# EasyEDA Pro project ProPrj_transverter-front-end_2026-04-14.epro, schematic transverter-control-board
Board Name: transverter-control-board; Create Date: 2026-04-02; Page Name: control-board; Project Name: transverter-front-end; Schematic Name: transverter-control-board; Update Date: 2026-04-08; Add into BOM: yes; Company: Your Company; Convert to PCB: yes; Date: 2026-03-10; Draw By: dbenhart; REV: 1.0; Sheet: 1/1; spicePre: .
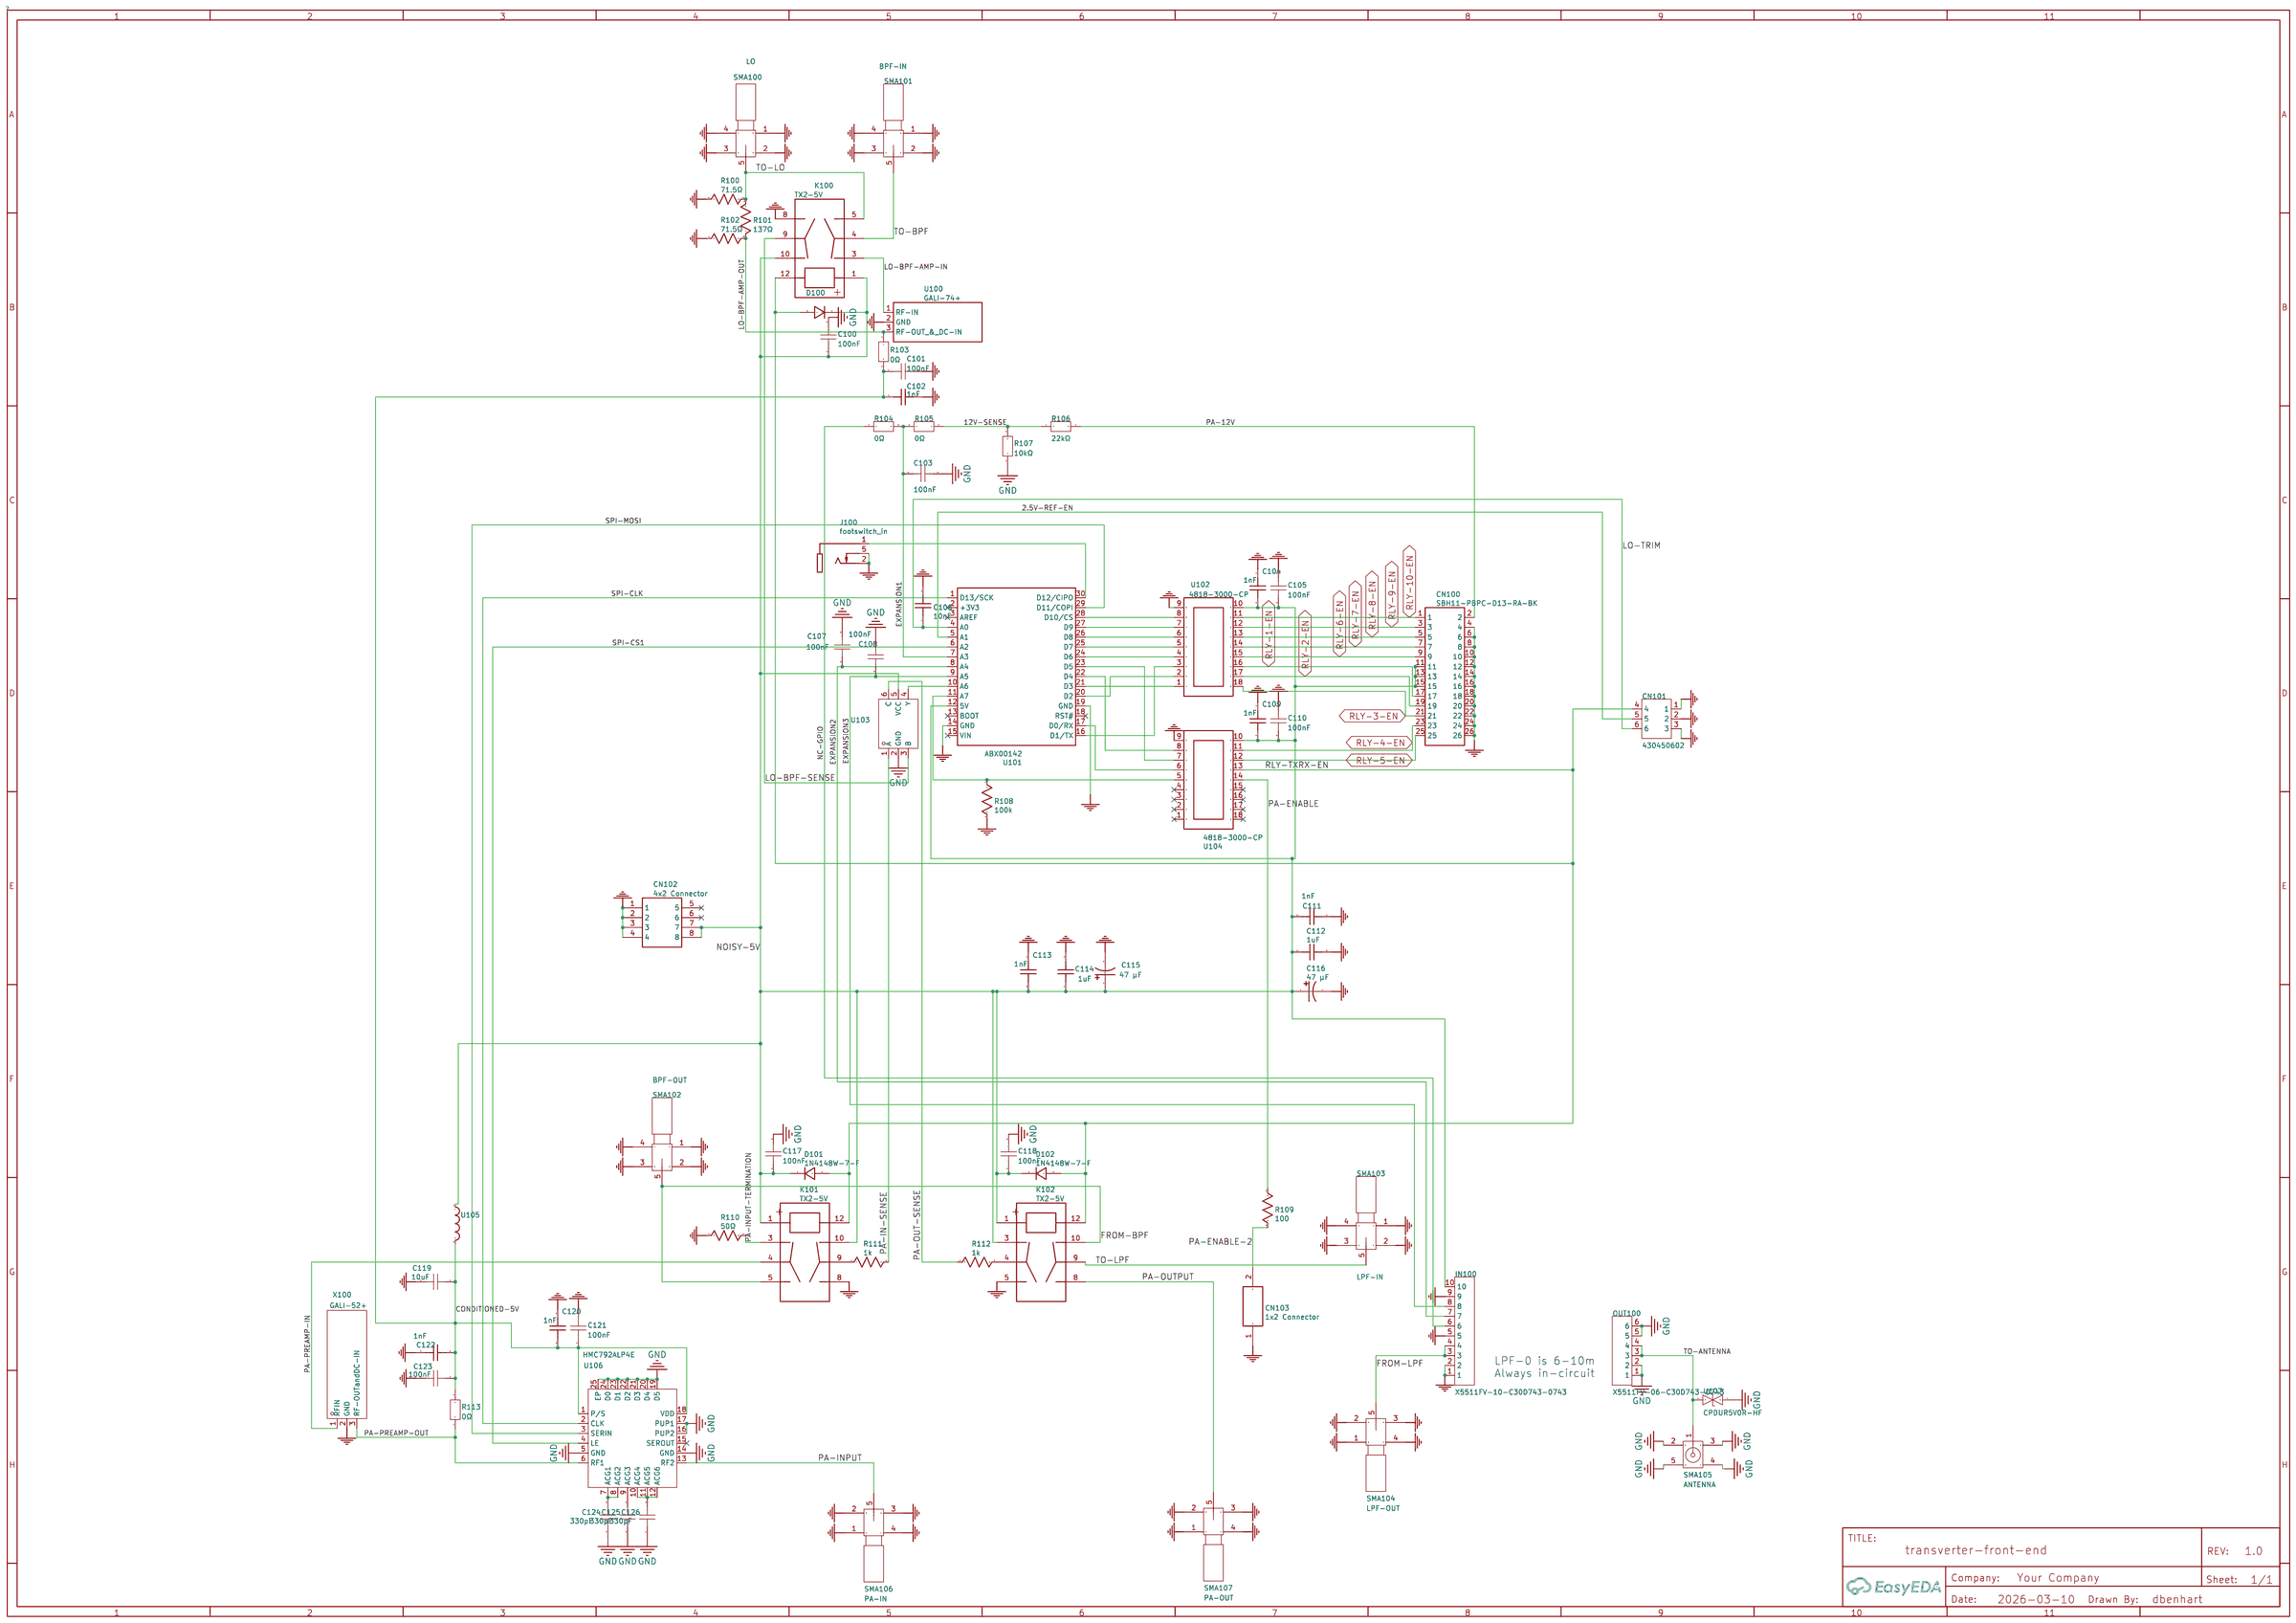
[diagram p1: schematic sheet]

## Parts
C100  100nF  [C0805]
C101  100nF  [C0805]
C102  1nF  [C0805]
C103  100nF  [C0603]
C104  1nF  [C0805]
C105  100nF  [C0805]
C106  10nF  [C0805]
C107  100nF  [C0603]
C108  100nF  [C0603]
C109  1nF  [C0805]
C110  100nF  [C0805]
C111  1nF  [C0805]
C112  1uF  [C0805]
C113  1nF  [C0805]
C114  1uF  [C0805]
C115  47 µF  [CAP-TH_BD8.0-P3.50-D0.6-FD]
C116  47 µF  [CAP-TH_BD8.0-P3.50-D0.6-FD]
C117  100nF  [C0805]
C118  100nF  [C0805]
C119  10uF  [C0805]
C120  1nF  [C0805]
C121  100nF  [C0805]
C122  1nF  [C0805]
C123  100nF  [C0805]
C124  330pF  [C0603]
C125  330pF  [C0603]
C126  330pF  [C0603]
CN100  SBH11-PBPC-D13-RA-BK  [IDC-TH_26P-P2.54-H-M-R2-C13-W8.8]
CN101  430450602  [CONN-TH_6P-P3.00_43045-0600]
CN102  4x2 Connector  [CONN-TH_0430450800]
CN103  1x2 Connector  [CONN-TH_43045-0200]
D100  1N4148W-7-F  [SOD-123_L2.7-W1.6-LS3.7-RD-1]
D101  1N4148W-7-F  [SOD-123_L2.7-W1.6-LS3.7-RD-1]
D102  1N4148W-7-F  [SOD-123_L2.7-W1.6-LS3.7-RD-1]
IN100  X5511FV-10-C30D743-0743  [HDR-TH_10P-P2.54-V-F-S2.54]
J100  footswitch_in  [SWITCHCRAFT_35RAPC2AVN4]
K100  TX2-5V  [RELAY-TH_TX2-3V]
K101  TX2-5V  [RELAY-TH_TX2-3V]
K102  TX2-5V  [RELAY-TH_TX2-3V]
OUT100  X5511FV-06-C30D743-0743  [HDR-TH_6P-P2.54_X5511FV-06-C30D743-0743]
R100  71.5Ω  [R0603_NEW]
R101  137Ω  [R0603_NEW]
R102  71.5Ω  [R0603_NEW]
R103  0Ω  [R0805]
R104  0Ω  [R0805]
R105  0Ω  [R0805]
R106  22kΩ  [R0805]
R107  10kΩ  [R0805]
R108  100k  [R0805]
R109  100  [R0805]
R110  50Ω  [R1206]
R111  1k  [R0805]
R112  1k  [R0805]
R113  0Ω  [R0805]
SMA100  LO  [ANT-TH_SMA-J-P-H-RA-TH1]
SMA101  BPF-IN  [ANT-TH_SMA-J-P-H-RA-TH1]
SMA102  BPF-OUT  [ANT-TH_SMA-J-P-H-RA-TH1]
SMA103  LPF-IN  [ANT-TH_SMA-J-P-H-RA-TH1]
SMA104  LPF-OUT  [ANT-TH_SMA-J-P-H-RA-TH1]
SMA105  ANTENNA  [SMA-TH_CONSMA002-L-G]
SMA106  PA-IN  [ANT-TH_SMA-J-P-H-RA-TH1]
SMA107  PA-OUT  [ANT-TH_SMA-J-P-H-RA-TH1]
U100  GALI-74+  [SOT-89-3_L4.5-W2.5-P1.50-LS4.2-BR]
U101  ABX00142  [ARDUINO-TH_L43.2-W17.8-P2.54-LS15.24-BL]
U102  4818-3000-CP  [DIP-18_L22.9-W10.2-P2.54-LS7.6-BL_100-183-100-1001-00]
U103  74LVC1G11W6-7  [SOT-26_L3.0-W1.6-P0.95-LS2.8-BL]
U104  4818-3000-CP  [DIP-18_L22.9-W10.2-P2.54-LS7.6-BL_100-183-100-1001-00]
U105  BLM31PG601SH1L  [L1206]
U106  HMC792ALP4E  [QFN-24_L4.0-W4.0-P0.50-TL-EP2.7]
U107  CPDUR5V0R-HF  [SOD-523F_L1.7-W1.0-BI]
X100  GALI-52+  [SOT-89-3_L4.5-W2.5-P1.50-LS4.2-BR]

## Library data of the parts
C100 C101 C105 C110 C117 C118 C121 C123 = KGM21NR71E104KT: Capacitance:100nF Tolerance:±10% Tolerance:±10% Voltage Rating:25V Temperature Coefficient:X7R; LCSC Part Name: 100nF ±10% 25V; Supplier Part: C20220997; Manufacturer: Kyocera AVX; JLCPCB Part Class: Extended Part; Supplier: LCSC; Tolerance: ±10%; Voltage Rating: 25V; Temperature Coefficient: X7R
C102 C104 C109 C111 C113 C120 C122 = 1nF: Supplier Part: 490-GCM2195C1K103FA16DCT-ND; Supplier: Digi-Key; Manufacturer Part: GRM033R71E102KA01J; voltage: 80; Manufacturer: Murata; nameAlias: Value(F); Contributor: LCEDA_Lib; spicePre: C; spiceSymbolName: C_0603_US; Package Display: No
C103 C107 C108 = KGM15BR71H104KT: Capacitance:100nF Tolerance:±10% Tolerance:±10% Voltage Rating:50V Temperature Coefficient:X7R; LCSC Part Name: 100nF ±10% 50V; Supplier Part: C18522987; Manufacturer: Kyocera AVX; Supplier Footprint: 0603; JLCPCB Part Class: Extended Part; Supplier: LCSC; Tolerance: ±10%; Voltage Rating: 50V; Temperature Coefficient: X7R; Check: false
C106 = 10nF: Supplier Part: 490-GCM2195C1K103FA16DCT-ND; Supplier: Digi-Key; Manufacturer Part: GCM2195C1K103FA16D; voltage: 80; Manufacturer: Murata; nameAlias: Value(F); Contributor: LCEDA_Lib; spicePre: C; spiceSymbolName: C_0603_US; Package Display: No
C112 C114 = 1uF: Supplier Part: 478-KGM21ER71E105KUCT-ND; Supplier: Digi-Key; Manufacturer Part: KGM21ER71E105KU; voltage: 25; Manufacturer: KYOCERA AVX; nameAlias: Value(F); Contributor: LCEDA_Lib; spicePre: C; spiceSymbolName: C_0603_US; Package Display: No
C115 C116 = EEH-AZA1H470B: Supplier: Digi-Key; Supplier Part: 10-EEH-AZA1H470BCT-ND; Manufacturer: PANASONIC(松下); JLCPCB Part Class: Extended Part; Contributor: lcsc; spicePre: C; spiceSymbolName: EEH-AZA1H680B
C119 = GRM21BZ71E106KE15L: Capacitance: Tolerance:±10% Tolerance:±10% Voltage Rating: Temperature Coefficient:; LCSC Part Name: 10uF ±10% 25V; Supplier Part: C237493; Manufacturer: muRata(村田); Supplier Footprint: 0805; JLCPCB Part Class: Extended Part; Datasheet: https://atta.szlcsc.com/upload/public/pdf/source/20200305/C490387_23319AE8C154DEB24C505E6C82A8106A.pdf; Supplier: LCSC; Tolerance: ±10%
C124-C126 = CAP_0603: Supplier Footprint: 0603; Manufacturer: KYOCERA AVX; Manufacturer Part: KGM15ACG1H331JT
CN100 = SBH11-PBPC-D13-RA-BK: Supplier: LCSC; Supplier Part: C17260960; Manufacturer: Sullins; JLCPCB Part Class: Extended Part; Contributor: lcsc; spicePre: C
CN101 = 430450602: Pins Structure:2x3P Pitch:3mm Mounting Type:Right-Angle Reference Series:Micro-Fit(MX 3.0) Number of Pins:6P Number of Rows:2 Number of PINs Per Row:3 Row Spacing:3mm Current Rating:8.5A Contact Material:Brass Contact Plating:Gold Operating Temperature:-4; LCSC Part Name: 2x3P 间距:3mm 弯插 系列:Micro-Fit(MX 3.0); Supplier Part: C587577; Manufacturer: MOLEX; JLCPCB Part Class: Extended Part; Datasheet: https://www.molex.com/content/dam/molex/molex-dot-com/products/automated/en-us/salesdrawingpdf/430/43045/430450602_sd.pdf?inline\; Supplier: LCSC; Pins Structure: 2x3P; Pitch: 3mm; Mounting Type: Right-Angle; Reference Series: Micro-Fit(MX 3.0); Number of Pins: 6P; Number of Rows: 2; Number of PINs Per Row: 3; Row Spacing: 3mm; Current Rating: 8.5A; Contact Material: Brass; Contact Plating: Gold; Operating Temperature: -40℃~+105℃; Voltage Rating: 600V; Flame Retardant Rating: UL94V-0; Supplementary Features: Fishhook Foot (Plastic); Color: Black; Z-Height of the Board: 8.77mm; X-Length of Bottom Edge on Board (Spacing Line): 12.65mm; Y-Width of Bottom Edge on Board: 12.24mm
CN102 = 0430450800: Supplier: LCSC; Manufacturer: MOLEX; Supplier Part: C122422; JLCPCB Part Class: Extended Part; spicePre: C
CN103 = 0430450200: Supplier: LCSC; Manufacturer: MOLEX; Supplier Part: C122431; JLCPCB Part Class: Extended Part; spicePre: C; Contributor: olcanut
D100-D102 = 1N4148W-7-F: Supplier: LCSC; Manufacturer: DIODES(美台); Supplier Part: C83528; JLCPCB Part Class: Extended Part; spicePre: D
IN100 = X5511FV-10-C30D743-0743: Holes Structure:1x10P Pitch:2.54mm Row Spacing:- Circular Hole / Square Hole:Round Hole Mounting Type:Through Hole Number of Rows:1 Number of Positions:10P Current Rating:3A Holes Direction:Top Insulation Height:3mm Contact Material:Brass Operating Temper; LCSC Part Name: 1x10P 间距:2.54mm 直插; Supplier Part: C5146770; Manufacturer: XKB Connection(中国星坤); JLCPCB Part Class: Extended Part; Datasheet: https://item.szlcsc.com/datasheet/X5511FV-10-C30D743-0743/5769479.html; Supplier: LCSC; Holes Structure: 1x10P; Pitch: 2.54mm; Circular Hole / Square Hole: Round Hole; Mounting Type: Through Hole; Number of Rows: 1; Number of Positions: 10P; Current Rating: 3A; Holes Direction: Top; Insulation Height: 3mm; Contact Material: Brass; Operating Temperature: -40℃~+105℃
J100 = footswitch_in: Manufacturer Part: 35RAPC2AVN4; Manufacturer: Switchcraft Inc.; Contributor: dbenhart; spicePre: J; spiceSymbolName: 35RAPC2AVN4
K100-K102 = TX2-5V: Supplier: LCSC; Supplier Part: C192257; Manufacturer: PANASONIC(松下); JLCPCB Part Class: Extended Part; Contributor: LCSC; spicePre: K
OUT100 = X5511FV-06-C30D743-0743: Holes Structure:1x6P Pitch:2.54mm Row Spacing:- Circular Hole / Square Hole:Round Hole Mounting Type:Through Hole Number of Rows:1 Number of Positions:6P Current Rating:3A Holes Direction:Top Insulation Height:3mm Contact Material:Brass Operating Temperat; LCSC Part Name: 1x6P 间距:2.54mm 直插; Supplier Part: C5146766; Manufacturer: XKB Connection(中国星坤); Supplier Footprint: 插件,P=2.54mm; JLCPCB Part Class: Extended Part; Datasheet: https://item.szlcsc.com/datasheet/X5511FV-06-C30D743-0743/5769475.html; Supplier: LCSC; Holes Structure: 1x6P; Pitch: 2.54mm; Circular Hole / Square Hole: Round Hole; Mounting Type: Through Hole; Number of Rows: 1; Number of Positions: 6P; Current Rating: 3A; Holes Direction: Top; Insulation Height: 3mm; Contact Material: Brass; Operating Temperature: -40℃~+105℃
R100 R102 = 75Ω: Manufacturer Part: TNPW060371R5BEEA; Manufacturer: Vishay Dale; nameAlias: Value(Ω); Contributor: LCEDA_Lib; spicePre: R; spiceSymbolName: R_0603_US; Package Display: No
R101 = 150Ω: Manufacturer Part: TNPW0603137RBEEA; Manufacturer: Vishay Dale; nameAlias: Value(Ω); Contributor: LCEDA_Lib; spicePre: R; spiceSymbolName: R_0603_US; Package Display: No
R103-R105 R113 = RCC08050000Z0EA: Type:Thick Film Resistor Resistance:0Ω Tolerance:- Tolerance:- Power(Watts):250mW Temperature Coefficient:- Temperature Coefficient:- Operating Temperature:-55℃~+155℃ Operating Temperature:-55℃~+155℃; LCSC Part Name: 厚膜电阻 0Ω 250mW; Supplier Part: C3953545; Manufacturer: VISHAY(威世); Supplier Footprint: 0805; JLCPCB Part Class: Extended Part; Datasheet: https://item.szlcsc.com/datasheet/RCC08050000Z0EA/4522105.html; Supplier: LCSC; Type: Thick Film Resistor; Power(Watts): 250mW; Operating Temperature: -55℃~+155℃
R106 = TNPW080510K0BEEA: Type:Thin Film Resistor Resistance:10kΩ Tolerance:±0.1% Tolerance:±0.1% Power(Watts):200mW Temperature Coefficient:±25ppm/℃ Temperature Coefficient:±25ppm/℃ Operating Temperature:-55℃~+155℃ Operating Temperature:-55℃~+155℃; LCSC Part Name: 薄膜电阻 22kΩ ±0.1% 200mW; Supplier Part: C844893; Manufacturer: VISHAY(威世); Manufacturer Part: TNPW080522K0BEEA; Supplier Footprint: 0805; JLCPCB Part Class: Extended Part; Datasheet: https://item.szlcsc.com/datasheet/TNPW080510K0BEEA/904467.html; Supplier: LCSC; Type: Thin Film Resistor; Tolerance: ±0.1%; Power(Watts): 200mW; Temperature Coefficient: ±25ppm/℃; Operating Temperature: -55℃~+155℃
R107 = TNPW080510K0BEEA: Type:Thin Film Resistor Resistance:10kΩ Tolerance:±0.1% Tolerance:±0.1% Power(Watts):200mW Temperature Coefficient:±25ppm/℃ Temperature Coefficient:±25ppm/℃ Operating Temperature:-55℃~+155℃ Operating Temperature:-55℃~+155℃; LCSC Part Name: 薄膜电阻 10kΩ ±0.1% 200mW; Supplier Part: C844893; Manufacturer: VISHAY(威世); Supplier Footprint: 0805; JLCPCB Part Class: Extended Part; Datasheet: https://item.szlcsc.com/datasheet/TNPW080510K0BEEA/904467.html; Supplier: LCSC; Type: Thin Film Resistor; Tolerance: ±0.1%; Power(Watts): 200mW; Temperature Coefficient: ±25ppm/℃; Operating Temperature: -55℃~+155℃
R108 = 100k: Manufacturer Part: TNPW0805100KFEEA; Manufacturer: Vishay Dale; nameAlias: Value(Ω); Contributor: LCEDA_Lib; spicePre: R; spiceSymbolName: R_0603_US
R109 = 100: Manufacturer Part: TNPW0805100RFHTA; Manufacturer: Vishay Dale; nameAlias: Value(Ω); Contributor: LCEDA_Lib; spicePre: R; spiceSymbolName: R_0603_US
R110 = 50Ω: Manufacturer Part: TNPW120650R0BEEN; Manufacturer: Vishay Dale; nameAlias: Value(Ω); Contributor: LCEDA_Lib; spicePre: R; spiceSymbolName: R_0603_US; Package Display: No
R111 R112 = 1k: Manufacturer Part: TNPW08051K00BYEA; Manufacturer: Vishay Dale; nameAlias: Value(Ω); Contributor: LCEDA_Lib; spicePre: R; spiceSymbolName: R_0603_US; Package Display: No
SMA100-SMA104 SMA106 SMA107 = SMA-J-P-H-RA-TH1_C6488932: Connector Type:Board Side Number of Ports:1 Frequency:20GHz RF Series:SMA Impedance:50Ω Rated Voltage (Max):335V Operating Temperature Range:-65℃~+125℃ Operating Temperature Range:-65℃~+125℃; LCSC Part Name: SMA; Supplier Part: C6488932; Manufacturer: SAMTEC; Manufacturer Part: SMA-J-P-H-RA-TH1; Supplier Footprint: 插件; JLCPCB Part Class: Extended Part; Datasheet: https://item.szlcsc.com/datasheet/SMA-J-P-H-RA-TH1/7442116.html; Supplier: LCSC; Connector Type: Board Side; Number of Ports: 1; RF Series: SMA; Impedance: 50Ω; Rated Voltage (Max): 335V; Operating Temperature Range: -65℃~+125℃
SMA105 = CONSMA002-L-G_C22417819: Connector Type:Board Side Interface:Inner Bore Number of Ports:1 Frequency:18GHz RF Series:SMA Impedance:50Ω Style:Elbow Operating Temperature Range:-65℃~+165℃ Operating Temperature Range:-65℃~+165℃; LCSC Part Name: 内孔 SMA 弯头; Supplier Part: C22417819; Manufacturer: TE Connectivity(泰科电子); Manufacturer Part: CONSMA002-L-G; Supplier Footprint: 弯插; JLCPCB Part Class: Extended Part; Datasheet: https://item.szlcsc.com/datasheet/CONSMA002-L-G/24041456.html; Supplier: LCSC; Connector Type: Board Side; Interface: Inner Bore; Number of Ports: 1; RF Series: SMA; Impedance: 50Ω; Style: Elbow; Operating Temperature Range: -65℃~+165℃
U100 = GALI-74+: Supplier: LCSC; Supplier Part: C879860; Manufacturer: Mini-Circuits; JLCPCB Part Class: Extended Part; Contributor: LCSC; spicePre: U
U101 = ABX00142: Supplier Part: C9900245380; Manufacturer: null; spicePre: U
U102 U104 = 4818-3000-CP: Supplier: LCSC; Supplier Part: C7185876; Manufacturer: 3M; JLCPCB Part Class: Extended Part; Contributor: lcsc; spicePre: U
U103 = 74LVC1G11W6-7: Logic Type:AND Gate Number of Channels:1 Voltage - Supply:1.65V~5.5V Voltage - Supply:1.65V~5.5V Quiescent Current:40uA Current - Output Low(IOL):32mA Current - Output High(IOH):32mA Input Logic Level - High:1.7V~2V Input Logic Level - High:1.7V~2V Input; Supplier Part: C460526; Manufacturer: DIODES(美台); Supplier Footprint: SOT-26; JLCPCB Part Class: Extended Part; Datasheet: https://item.szlcsc.com/datasheet/74LVC1G11W6-7/464955.html; Supplier: LCSC; Logic Type: AND Gate; Number of Channels: 1; Voltage - Supply: 1.65V~5.5V; Quiescent Current: 40uA; Current - Output Low(IOL): 32mA; Current - Output High(IOH): 32mA; Input Logic Level - High: 1.7V~2V; Series: 74LVCSeries; Propagation Delay: 3.5ns@5V,50pF; Operating Temperature: -40℃~+125℃
U105 = BLM31PG601SH1L: Supplier: LCSC; Supplier Part: C167450; Manufacturer: muRata(村田); JLCPCB Part Class: Extended Part; Contributor: LCSC; spicePre: U; Package Display: No
U106 = HMC792ALP4E: Frequency Range:0Hz~6GHz Frequency Range:0Hz~6GHz Power(Watts):715mW Impedance:50Ω Attenuation Value:15.75dB Attenuation Value:15.75dB Operating Temperature:- Operating Temperature:- Step Size:0.25dB Insertion Loss:4dB；2.4dB; LCSC Part Name: 0.25 dB LSB GaAs MMIC 6位数字衰减器，采用SMT封装，DC - 6 GHz; Supplier Part: C706730; Manufacturer: ADI(亚德诺); Supplier Footprint: QFN-24-EP(4x4); JLCPCB Part Class: Extended Part; Datasheet: https://item.szlcsc.com/datasheet/HMC792ALP4E/743825.html; Supplier: LCSC; Frequency Range: 0Hz~6GHz; Power(Watts): 715mW; Impedance: 50Ω; Attenuation Value: 15.75dB; Step Size: 0.25dB; Insertion Loss: 4dB；2.4dB
U107 = CPDUR5V0R-HF: Reverse Stand-Off Voltage (Vrwm):5V Maximum Clamping Voltage:13V Peak Pulse Current (Ipp):12A@8/20us Peak Pulse Power Dissipation (Ppp):- Breakdown Voltage:5.6V Type:TVS; LCSC Part Name: TVS 5V截止 12A峰值脉冲; Supplier Part: C2443353; Manufacturer: Comchip(典琦); Supplier Footprint: SOD-523F(0603); JLCPCB Part Class: Extended Part; Datasheet: https://atta.szlcsc.com/upload/public/pdf/source/20240124/4F967C0056EC9CD23683E7FA15AA3325.pdf; Supplier: LCSC; Reverse Stand-Off Voltage (Vrwm): 5V; Maximum Clamping Voltage: 20V; Peak Pulse Current (Ipp): 3A@10/1000us; Breakdown Voltage: 6V; Type: TVS
X100 = GALI-52+: Applications:Mobile Phone；PCS Frequency Range:0Hz~2GHz Frequency Range:0Hz~2GHz Gain:14.4dB Noise Figure:2.7dB Supply Voltage:4V~4.8V Supply Voltage:4V~4.8V Supply Current:50mA; LCSC Part Name: GALI-52+ DC-2 GHz InGaP HBT 射频放大器; Supplier Part: C2683445; Manufacturer: Mini-Circuits; Supplier Footprint: SOT-89-3; JLCPCB Part Class: Extended Part; Datasheet: https://atta.szlcsc.com/upload/public/pdf/source/20210107/C2683445_4C019D776B336260B8EA539DE99FD577.pdf; Supplier: LCSC; Applications: Mobile Phone；PCS; Frequency Range: 0Hz~2GHz; Gain: 14.4dB; Noise Figure: 2.7dB; Supply Voltage: 4V~4.8V; Supply Current: 50mA

## Nets
2.5V-REF-EN: CN101.5 U101.5(A1)
12V-SENSE: R105.1 R106.1 R107.2
GND: C100.2 C101.2 C102.1 C103.1 C104.1 C105.2 C106.2 C107.1 C108.1 C109.1 C110.2 C111.1 C112.2 C113.1 C114.2 C115.2 C116.2 C117.2 C118.2 C119.1 C120.1 C121.2 C122.1 C123.2 C124.1 C125.1 C126.1 CN100.4 CN100.6 CN100.8 CN100.10 CN100.12 CN100.14 CN100.16 CN100.18 CN100.20 CN100.22 CN100.24 CN100.26 CN101.1 CN101.2 CN101.3 CN102.1 CN102.2 CN102.3 CN102.4 CN103.1 IN100.1 IN100.2 IN100.5 IN100.9 J100.2 J100.5 K100.8 K101.8 K102.5 OUT100.1 OUT100.2 OUT100.5 OUT100.6 R100.1 R102.1 R107.1 R108.2 R110.1 SMA100.1 SMA100.2 SMA100.3 SMA100.4 SMA101.1 SMA101.2 SMA101.3 SMA101.4 SMA102.1 SMA102.2 SMA102.3 SMA102.4 SMA103.1 SMA103.2 SMA103.3 SMA103.4 SMA104.1 SMA104.2 SMA104.3 SMA104.4 SMA105.2 SMA105.3 SMA105.4 SMA105.5 SMA106.1 SMA106.2 SMA106.3 SMA106.4 SMA107.1 SMA107.2 SMA107.3 SMA107.4 U100.2(GND) U101.14(GND) U101.19(GND) U102.9 U103.2(GND) U104.9 U106.5(GND) U106.14(GND) U106.16(PUP2) U106.17(PUP1) U106.19(D5) U106.20(D4) U106.21(D3) U106.22(D2) U106.23(D1) U106.24(D0) U106.25(EP) U107.1 X100.2(GND)
CONDITIONED-5V: C101.1 C102.2 C119.2 C120.2 C121.1 C122.2 C123.1 R103.2 R113.2 U105.2 U106.1(P/S) U106.18(VDD)
EXPANSION1: C103.2 R104.2 R105.2 U101.7(A3)
EXPANSION2: C107.2 IN100.7 U101.8(A4)
EXPANSION3: C108.2 IN100.8 U101.9(A5)
FROM-BPF: K101.5 K102.10 SMA102.5
FROM-LPF: IN100.3 IN100.4 SMA104.5
LO-BPF-AMP-IN: K100.3 U100.1(RF-IN)
LO-BPF-AMP-OUT: R101.1 R102.2 R103.1 U100.3(RF-OUT & DC-IN)
LO-BPF-SENSE: K100.9 U103.3(B)
LO-TRIM: C106.1 CN101.6 U101.4(A0)
NC-GPIO: IN100.6 R104.1
NOISY-5V: C100.1 C104.2 C105.1 C109.2 C110.1 C111.2 C112.1 C113.2 C114.1 C115.1 C116.1 C117.1 C118.1 CN100.11 CN100.13 CN100.15 CN102.7 CN102.8 D100.1(C) D101.1(C) D102.1(C) IN100.10 K100.1 K100.10 K101.1 K101.10 K102.1 K102.3 U101.12(5V) U102.10 U103.5(VCC) U104.10 U105.1
PA-12V: CN100.2 R106.2
PA-ENABLE: R109.1 U104.14
PA-ENABLE-2: CN103.2 R109.2
PA-IN-SENSE: R111.2 U103.1(A)
PA-INPUT: SMA106.5 U106.13(RF2)
PA-INPUT-TERMINATION: K101.3 R110.2
PA-OUT-SENSE: R112.1 U103.6(C)
PA-OUTPUT: K102.8 SMA107.5
PA-PREAMP-IN: K101.4 X100.1(RFIN)
PA-PREAMP-OUT: R113.1 U106.6(RF1) X100.3(RF-OUTandDC-IN)
RLY-1-EN: CN100.17 U102.16
RLY-2-EN: CN100.19 U102.17
RLY-3-EN: CN100.21 U102.18
RLY-4-EN: CN100.23 U104.11
RLY-5-EN: CN100.25 U104.12
RLY-6-EN: CN100.9 U102.15
RLY-7-EN: CN100.7 U102.14
RLY-8-EN: CN100.5 U102.13
RLY-9-EN: CN100.3 U102.12
RLY-10-EN: CN100.1 U102.11
RLY-TXRX-EN: CN101.4 D100.2(A) D101.2(A) D102.2(A) K100.12 K101.12 K102.12 U104.13
SPI-CLK: U101.1(D13/SCK) U106.2(CLK)
SPI-CS1: U101.6(A2) U106.4(LE)
SPI-MOSI: U101.29(D11/COPI) U106.3(SERIN)
TO-ANTENNA: OUT100.3 OUT100.4 SMA105.1 U107.2
TO-BPF: K100.4 SMA101.5
TO-LO: K100.5 R100.2 R101.2 SMA100.5
TO-LPF: K102.9 SMA103.5
$C124_2: C124.2 U106.7(ACG1) U106.8(ACG2)
$C125_2: C125.2 U106.9(ACG3)
$C126_2: C126.2 U106.10(ACG4) U106.11(ACG5) U106.12(ACG6)
$J100_1: J100.1 U101.30(D12/CIPO)
$K101_9: K101.9 R111.1
$K102_4: K102.4 R112.2
$R108_1: R108.1 U101.11(A7) U104.5
$U101_10: U101.10(A6) U103.4(Y)
$U101_16: U101.16(D1/TX) U102.3
$U101_17: U101.17(D0/RX) U104.6
$U101_20: U101.20(D2) U102.2
$U101_21: U101.21(D3) U102.1
$U101_22: U101.22(D4) U104.8
$U101_23: U101.23(D5) U104.7
$U101_24: U101.24(D6) U102.4
$U101_25: U101.25(D7) U102.5
$U101_26: U101.26(D8) U102.6
$U101_27: U101.27(D9) U102.7
$U101_28: U101.28(D10/CS) U102.8

Not connected (* = marked no-connect by the designer): CN102 5* 6*; U101 2(+3V3)* 3(AREF)* 13(BOOT)* 15(VIN)* 18(RST#)*; U104 1* 2* 3* 4* 15* 16* 17* 18*; U106 15(SEROUT)*

## Notes on the sheet
- LPF-0 is 6-10m
  Always in-circuit
